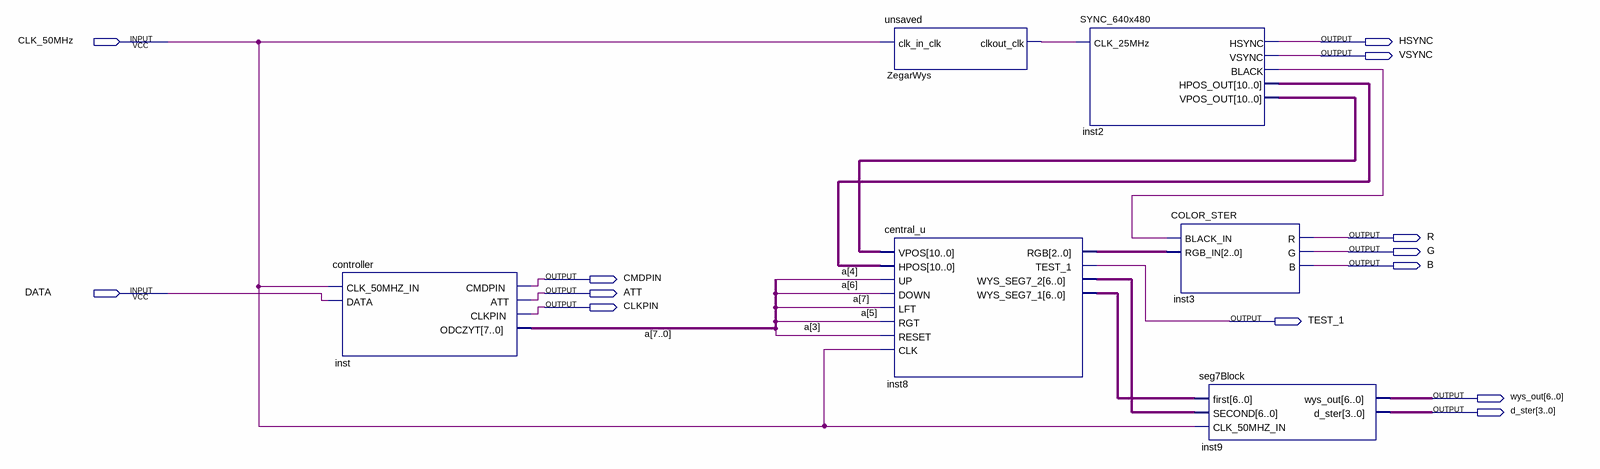
[diagram p0: schematic sheet]
// Quartus schematic Snake.bdf as structural Verilog: 6 symbols, 13 pins
module Snake (
  input  CLK_50MHz,
  input  DATA,
  output HSYNC,
  output VSYNC,
  output R,
  output G,
  output B,
  output CMDPIN,
  output ATT,
  output CLKPIN,
  output TEST_1,
  output [6:0] wys_out,
  output [3:0] d_ster
);

  wire inst2_black, ZegarWys_clkout_clk;
  wire [2:0] inst8_rgb;
  wire [6:0] inst8_wys_seg7_1, inst8_wys_seg7_2;
  wire [7:0] a;
  wire [10:0] inst2_hpos_out, inst2_vpos_out;

  controller inst (.CLK_50MHZ_IN(CLK_50MHz), .DATA(DATA), .CMDPIN(CMDPIN), .ATT(ATT), .CLKPIN(CLKPIN), .ODCZYT(a));
  unsaved ZegarWys (.clk_in_clk(CLK_50MHz), .clkout_clk(ZegarWys_clkout_clk));
  central_u inst8 (
    .VPOS(inst2_vpos_out), .HPOS(inst2_hpos_out), .UP(a[4]), .DOWN(a[6]), .LFT(a[7]), .RGT(a[5]),
    .RESET(a[3]), .CLK(CLK_50MHz), .RGB(inst8_rgb), .TEST_1(TEST_1), .WYS_SEG7_2(inst8_wys_seg7_2),
    .WYS_SEG7_1(inst8_wys_seg7_1));
  SYNC_640x480 inst2 (
    .CLK_25MHz(ZegarWys_clkout_clk), .HSYNC(HSYNC), .VSYNC(VSYNC), .BLACK(inst2_black),
    .HPOS_OUT(inst2_hpos_out), .VPOS_OUT(inst2_vpos_out));
  COLOR_STER inst3 (.BLACK_IN(inst2_black), .RGB_IN(inst8_rgb), .R(R), .G(G), .B(B));
  seg7Block inst9 (
    .first(inst8_wys_seg7_1), .SECOND(inst8_wys_seg7_2), .CLK_50MHZ_IN(CLK_50MHz), .wys_out(wys_out),
    .d_ster(d_ster));
endmodule
